# EAGLE design Adafruit 2.13in eInk Bonnet (EAGLE 9.6.2)
COMPANY: ADAFRUIT INDUSTRIES; DRAWN: K. TOWNSEND; REV: A
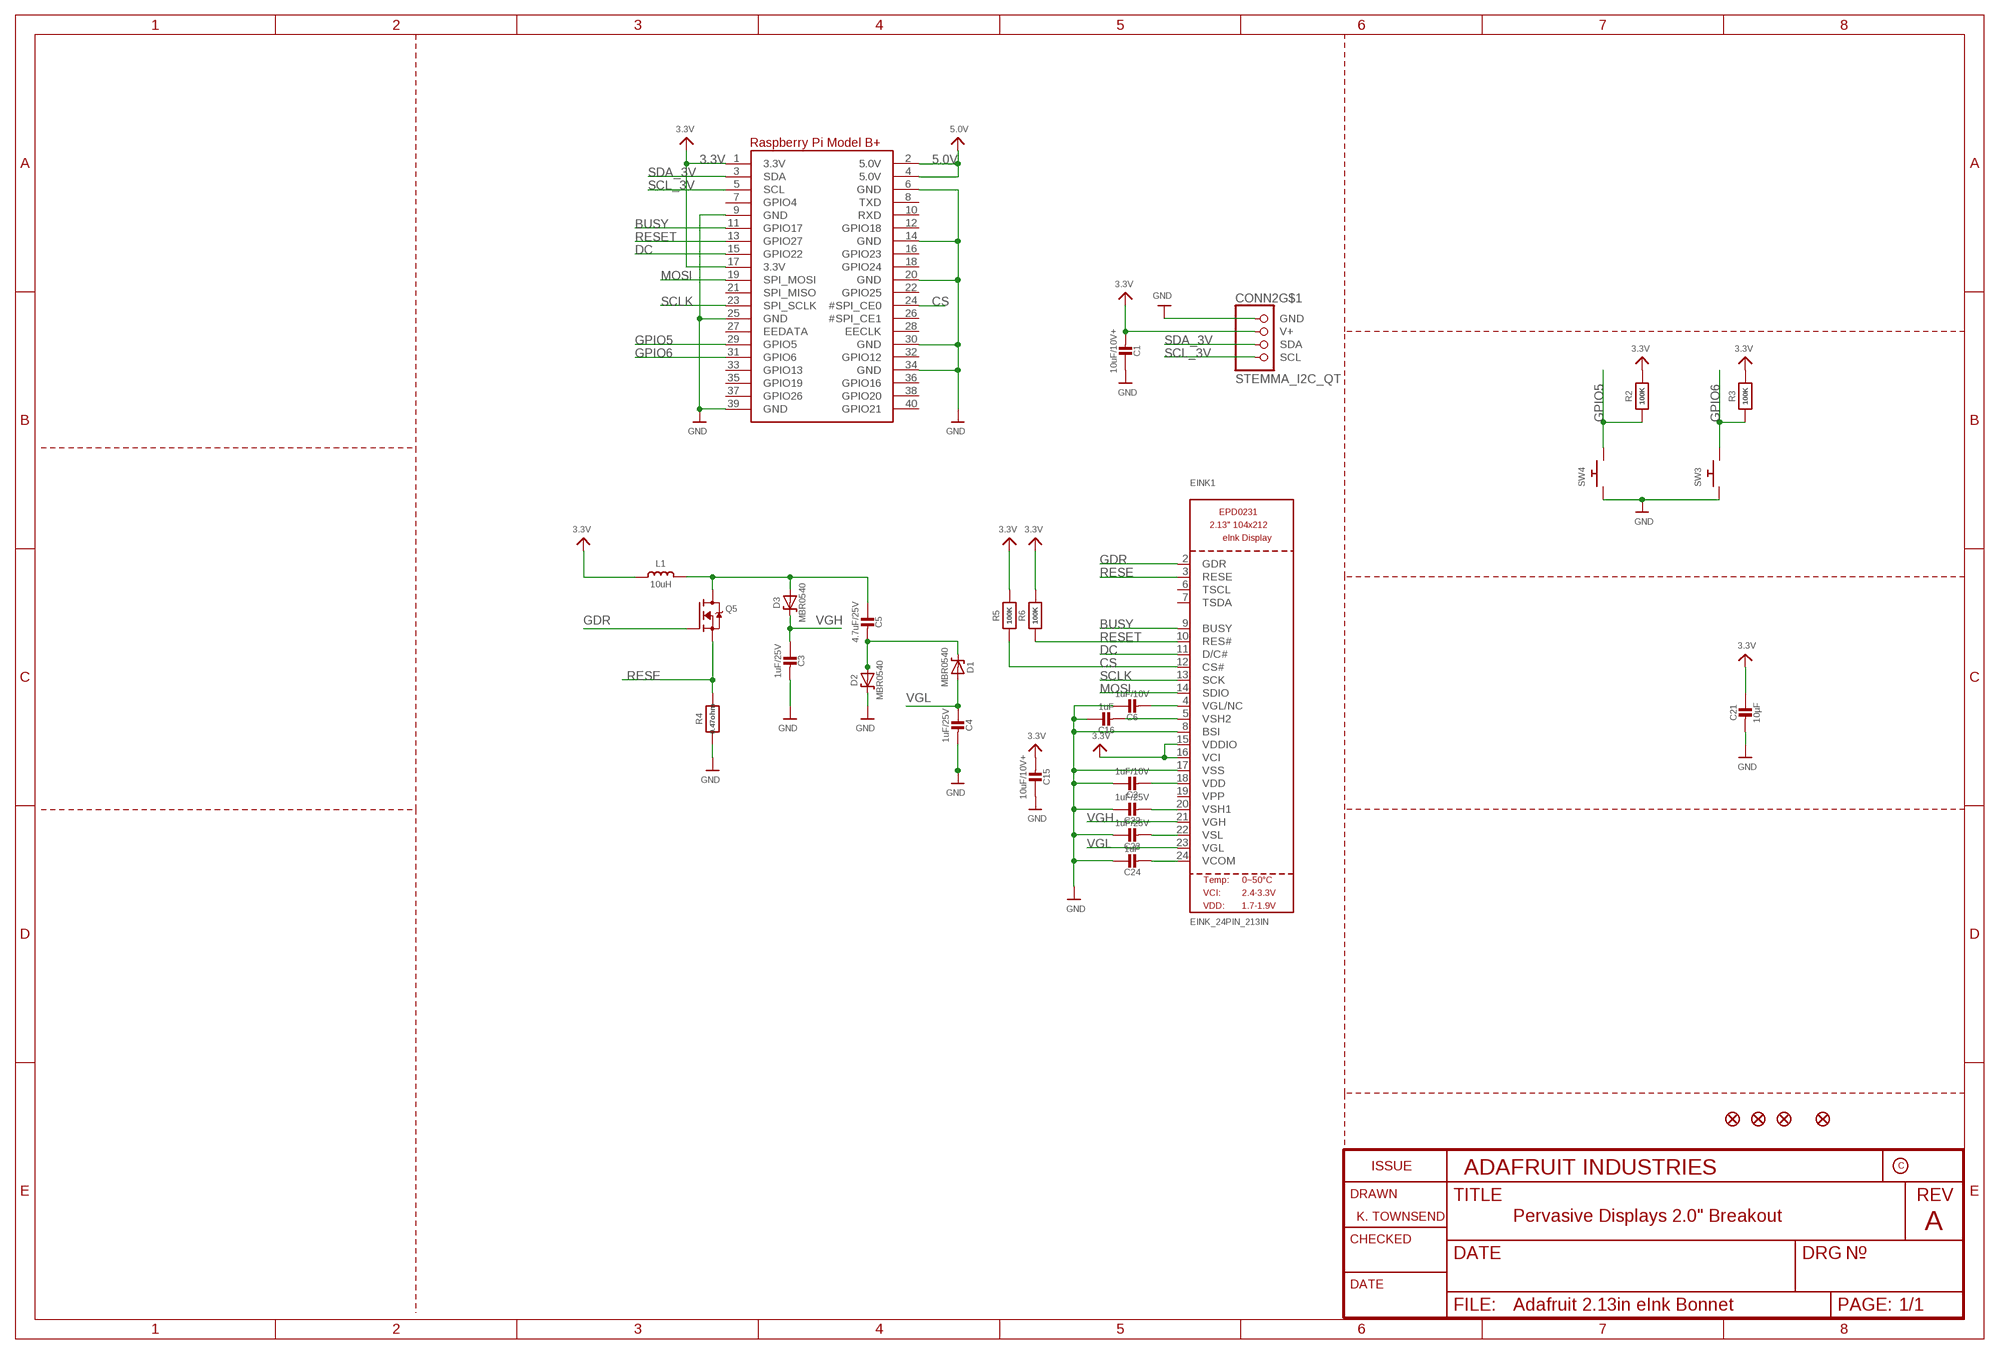
[diagram p0: schematic, sheet 1]

## Parts
C1  10uF/10V+  CAP_CERAMIC0805-NOOUTLINE  [0805-NO]
C2  1uF/10V  CAP_CERAMIC0805-NOOUTLINE  [0805-NO]
C3  1uF/25V  CAP_CERAMIC0805-NOOUTLINE  [0805-NO]
C4  1uF/25V  CAP_CERAMIC0805-NOOUTLINE  [0805-NO]
C5  4.7uF/25V  CAP_CERAMIC0805-NOOUTLINE  [0805-NO]
C6  1uF/10V  CAP_CERAMIC0805-NOOUTLINE  [0805-NO]
C15  10uF/10V+  CAP_CERAMIC0805-NOOUTLINE  [0805-NO]
C16  1uF  CAP_CERAMIC0805-NOOUTLINE  [0805-NO]
C21  10µF  CAP_CERAMIC0805-NOOUTLINE  [0805-NO]
C22  1uF/25V  CAP_CERAMIC0805-NOOUTLINE  [0805-NO]
C23  1uF/25V  CAP_CERAMIC0805-NOOUTLINE  [0805-NO]
C24  1uF  CAP_CERAMIC0805-NOOUTLINE  [0805-NO]
CONN2  STEMMA_I2C_QT  [JST_SH4]
D1  MBR0540  DIODE-SCHOTTKYSOD-123  [SOD-123]
D2  MBR0540  DIODE-SCHOTTKYSOD-123  [SOD-123]
D3  MBR0540  DIODE-SCHOTTKYSOD-123  [SOD-123]
EINK1  EINK_24PIN_213IN  [EINK_213IN_104X212]
FID1  FIDUCIAL_1MM  [FIDUCIAL_1MM]
FID2  FIDUCIAL_1MM  [FIDUCIAL_1MM]
FID3  FIDUCIAL_1MM  [FIDUCIAL_1MM]
FID4  FIDUCIAL_1MM  [FIDUCIAL_1MM]
L1  10uH  INDUCTORNR401  [INDUCTOR_4X4MM_NR401]
Q5  IRLML0100  IRLML2060TRPBF  [SOT23-3]
R2  100K  RESISTOR_0603_NOOUT  [0603-NO]
R3  100K  RESISTOR_0603_NOOUT  [0603-NO]
R4  0.47ohm  RESISTOR0805_10MGAP  [0805_10MGAP]
R5  100K  RESISTOR_0603_NOOUT  [0603-NO]
R6  100K  RESISTOR_0603_NOOUT  [0603-NO]
RPI2  RASPBERRYPI_BPLUS_SMT_NODIM  [PI_BONNET_SMT_NODIM]
SW3  SWITCH_PUSHBUTTON_3.5X6MM  [TACTILE_3X6MM]
SW4  SWITCH_PUSHBUTTON_3.5X6MM  [TACTILE_3X6MM]

## Nets
3.3V: C1.2 C15.2 C21.1 CONN2.2(V+) EINK1.15(VDDIO) EINK1.16(VCI) L1.P$2 R2.2 R3.2 R5.2 R6.2 RPI2.1(3.3V) RPI2.17(3.3V)
5.0V: RPI2.2(5.0V) RPI2.4(5.0V)
BUSY: EINK1.9(BUSY) RPI2.11(GPIO17)
CS: EINK1.12(CS#) R5.1 RPI2.24(#SPI_CE0)
DC: EINK1.11(D/C#) RPI2.15(GPIO22)
GDR: EINK1.2(GDR) Q5.1(G)
GND: C1.1 C2.1 C3.2 C4.2 C6.1 C15.1 C16.1 C21.2 C22.1 C23.1 C24.1 CONN2.1(GND) D2.C EINK1.8(BSI) EINK1.17(VSS) R4.2 RPI2.6(GND) RPI2.9(GND) RPI2.14(GND) RPI2.20(GND) RPI2.25(GND) RPI2.30(GND) RPI2.34(GND) RPI2.39(GND) SW3.P$1 SW4.P$1
GPIO5: R2.1 RPI2.29(GPIO5) SW4.P$2
GPIO6: R3.1 RPI2.31(GPIO6) SW3.P$2
MOSI: EINK1.14(SDIO) RPI2.19(SPI_MOSI)
N$2: C5.2 D1.C D2.A
N$3: C5.1 D3.A L1.P$1 Q5.3(D)
N$4: C16.2 EINK1.5(VSH2)
N$5: C2.2 EINK1.18(VDD)
N$6: C22.2 EINK1.20(VSH1)
N$9: C6.2 EINK1.4(VGL/NC)
N$27: C23.2 EINK1.22(VSL)
N$33: C24.2 EINK1.24(VCOM)
RESE: EINK1.3(RESE) Q5.2(S) R4.1
RESET: EINK1.10(RES#) R6.1 RPI2.13(GPIO27)
SCL_3V: CONN2.4(SCL) RPI2.5(SCL)
SCLK: EINK1.13(SCK) RPI2.23(SPI_SCLK)
SDA_3V: CONN2.3(SDA) RPI2.3(SDA)
VGH: C3.1 D3.C EINK1.21(VGH)
VGL: C4.1 D1.A EINK1.23(VGL)
Unconnected: CONN2.MT1(MT) CONN2.MT2(MT) EINK1.6(TSCL) EINK1.7(TSDA) EINK1.19(VPP) RPI2.7(GPIO4) RPI2.8(TXD) RPI2.10(RXD) RPI2.12(GPIO18) RPI2.16(GPIO23) RPI2.18(GPIO24) RPI2.21(SPI_MISO) RPI2.22(GPIO25) RPI2.26(#SPI_CE1) RPI2.27(EEDATA) RPI2.28(EECLK) RPI2.32(GPIO12) RPI2.33(GPIO13) RPI2.35(GPIO19) RPI2.36(GPIO16) RPI2.37(GPIO26) RPI2.38(GPIO20) RPI2.40(GPIO21)

## Notes on the sheet
- Pervasive Displays 2.0" Breakout

## Library data of the parts
C1-C6 C15 C16 C21-C24 = microbuilder:CAP_CERAMIC: Ceramic Capacitors For new designs, use the packages preceded by an '_' character since they are more reliable: The following footprints should be used on most boards: _0402 - Standard footprint for regular board layouts _0603 - Standard footprint for regular board layouts _0805 - Standard footprint for regular board layouts _1206 - Standard footprint for regular board layouts For extremely tight-pitch boards where space is at a premium, the following 'micro-pitch' footprints can be used (smaller pads, no silkscreen outline, etc.): _0402MP - Micro-pitch footprint for very dense/compact boards _0603MP - Micro-pitch footprint for very dense/compact boards _0805MP - Micro-pitch footprint for very dense/compact boards _1206MP - Micro-pitch footprint for very dense/compact boards
CONN2 = microbuilder:STEMMA_I2C
D1-D3 = microbuilder:DIODE-SCHOTTKY
EINK1 = adafruit_display:EINK_24PIN
FID1-FID4 = microbuilder:FIDUCIAL: Fiducial Alignment Points Various fiducial points for machine vision alignment.; BOM: EXCLUDE
L1 = microbuilder:INDUCTOR: Inductors 0603: 10nH Ceramic Inductor - microwire antenna/RF (Digikey: 712-1434-2-ND) 0805: 560nH Ceramic Inductor - RF (Digikey: 553-1047-1-ND) 270nH Ceramic Inductor - Q = 40@250MHz, +-5%, 1 Ohm DC Resistance (Digikey: 535-10506-2-ND) 1007 (2518 Metric) SMT: 10µH 10% 250mOhm 820mA 1007 Inductor (Digikey: 587-2189-1-ND) 22µH 10% 500mOhm 580mA 1007 Inductor (Digikey: 587-2190-1-ND) 47µH 10% 950mOhm 420mA 1007 Inductor (Digikey: 587-2191-1-ND) 47µH 5% 100mOhm 1A 1008 Inductor (Digikey: 732-1816-1-ND) 5.0x5.0mm (Taiyo Yuden NR5040 Series) 6.8µH 20% 2.3A 64mOhm Inductor (Digikey: 587-2374-2-ND) 5.0x5.0mm (TDK VLC5045 Series) 4.7µH 20% 3.3A 34mOhm Inductor (Digikey: 445-6526-1-ND) 6.8µH 20% 2.7A 46mOhm Inductor (Digikey: 445-6527-1-ND) 6.0x6.0mm (TDK VLC6045 Series) 4.7µH 20% 3.8A 27mOhm Inductor (Digikey: 445-6538-2-ND) 6.8µH 20% 3A 41mOhm Inductor (Digikey: 445-6540-1-ND) 6.2µH 30% 2.2A 45mOhm Inductor (Digikey: SRR5028-6R2YCT-ND) - Not TDK VLC6045 but footprint should match 6.0x6.0mm (TDK SLF6045 Series) 6.8uH 30% 2A 33mOhm Inductor (Digikey: 445-4572-1-ND, Mouser: 810-SLF645T6R8N2R0PF) 6.0x6.0mm (Sumida CDRH5D28 Series) 6.2uH 30% 1.8A 45mOhm Inductor (Digikey: 308-1542-1-ND) Taiyo Yuden NR3015T2R2M - 2.2uH 20% 1.5A (Digikey: 587-1648-2-ND, Mouser: 963-NR3015T2R2M) - Used with TI TPS62172 CoilCraft RFID Transponder Coil - MA5532-AE (For use with AS3935 Lightning Sensor) Taiyo Yuden NRH2412T2R2MNGH - 2.2uH 20% 1AA (Digikey: 587-3443-1-ND) - Used with TI LM3671 Vishay IHLP 1.0uH Molded Inductor - 24mOhm DCR, 5A, +/-20%, -55°C-125°C (Digikey: 541-1319-1-ND)
Q5 = Parts:IRLML2060TRPBF
R2-R6 = microbuilder:RESISTOR: Resistors For new designs, use the packages preceded by an '_' character since they are more reliable: The following footprints should be used on most boards: _0402 - Standard footprint for regular board layouts _0603 - Standard footprint for regular board layouts _0805 - Standard footprint for regular board layouts _1206 - Standard footprint for regular board layouts For extremely tight-pitch boards where space is at a premium, the following 'micro-pitch' footprints can be used (smaller pads, no silkscreen outline, etc.): _0402MP - Micro-pitch footprint for very dense/compact boards _0603MP - Micro-pitch footprint for very dense/compact boards _0805MP - Micro-pitch footprint for very dense/compact boards _1206MP - Micro-pitch footprint for very dense/compact boards
RPI2 = adafruit_sbc:RASPBERRYPI_BPLUS
SW3 SW4 = microbuilder:SWITCH_PUSHBUTTON: Buttons SOFTTOUCHSMD_SJ - Soft touch temporary push button (Super Junk Akihabara) Compatible with SKPMANE010 [Mouser: 688-SKPMAN] C&K_KSS = Digikey: KSS221GLFS

## Net classes
1 power: width 0.305 mm

## Board
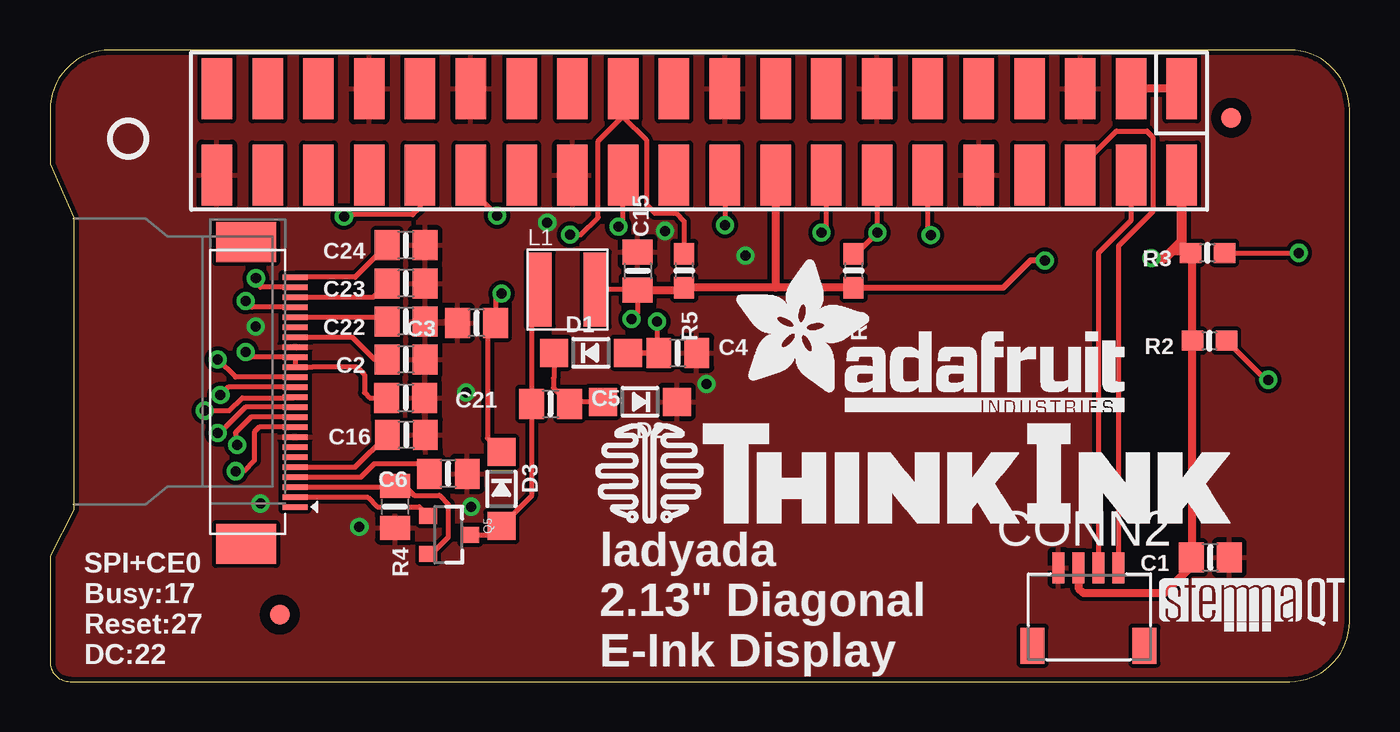
[diagram p1: board, top side]
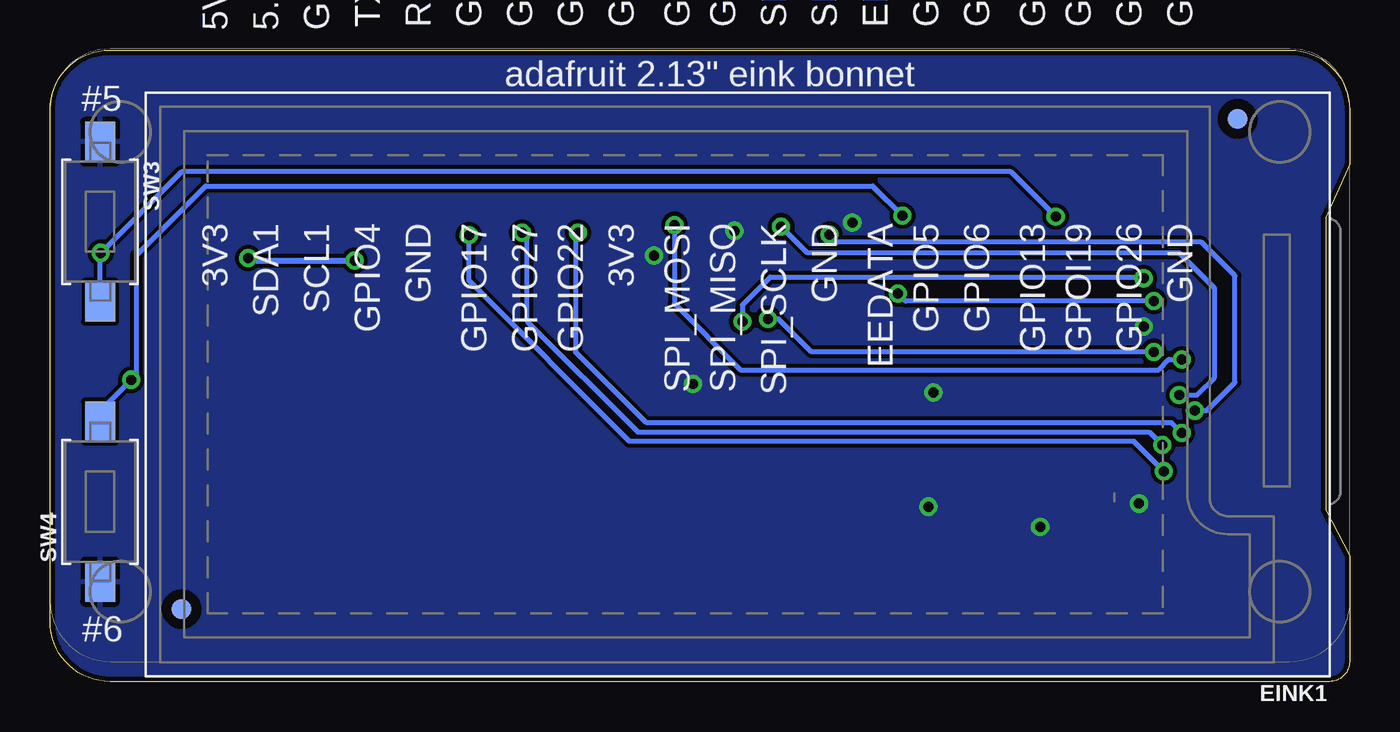
[diagram p2: board, bottom side, seen from below]

Size 65 x 31.6 mm. Coordinates in mm from the lower left corner, seen from the top.
Outline: 0,28.6 0,25.9 1.2,23.2 1.2,8.6 0,6.3 0,1 arc90 1,0 62,0 arc90 65,3 65,28.6 arc90 62,31.6 3,31.6 arc90 0,28.6
Copper layers (1*16): Top 0.035mm / dielectric 1.5mm / Bottom 0.035mm
Design rules "adafruit *": minimum track width 8mil, minimum drill 15.5mil, track to track 8mil, track to pad 8mil, pad to pad 8mil, via to via 8mil, smd to smd 8mil, copper to edge 10mil, drill to drill 8mil, minimum pad ring 10mil, minimum via ring 8mil, stop-mask expansion 2mil, vias tented up to drill 20mil, thermal gap 10mil

### Footprints (pad centres in the part's own frame; a part is rotated, then mirrored left to right if it is on the bottom)
0805-NO = smd 1.24 x 1.5: 1 -0.95,0; 2 0.95,0
JST_SH4 = smd 0.6 x 1.55: 1 -1.5,2.514; 2 -0.5,2.514; 3 0.5,2.514; 4 1.5,2.514 | smd 1.2 x 1.8: MT1 -2.8,-1.386; MT2 2.8,-1.386
SOD-123 = smd 1.4 x 1.4: A 1.85,0; C -1.85,0
EINK_213IN_104X212 = smd 1.25 x 0.275 bottom: 1 11.26,-8.46; 2 11.26,-8.96; 3 11.26,-9.46; 4 11.26,-9.96; 5 11.26,-10.46; 6 11.26,-10.96; 7 11.26,-11.46; 8 11.26,-11.96; 9 11.26,-12.46; 10 11.26,-12.96; 11 11.26,-13.46; 12 11.26,-13.96; 13 11.26,-14.46; 14 11.26,-14.96; 15 11.26,-15.46; 16 11.26,-15.96; 17 11.26,-16.46; 18 11.26,-16.96; 19 11.26,-17.46; 20 11.26,-17.96; 21 11.26,-18.46; 22 11.26,-18.96; 23 11.26,-19.46; 24 11.26,-19.96 | smd 3 x 2 bottom: SPRT1 8.8,-6.61; SPRT2 8.8,-21.72
FIDUCIAL_1MM = smd 1 x 1: 1 0,0
INDUCTOR_4X4MM_NR401 = smd 1.2 x 3.7: P$1 -1.4,0; P$2 1.4,0
SOT23-3 = smd 0.8 x 0.9: 1 -0.95,-1; 2 0.95,-1; 3 0,1.1
0603-NO = smd 1.075 x 1: 1 -0.85,0; 2 0.85,0
0805_10MGAP = smd 1.2 x 1.5: 1 -1.05,0; 2 1.05,0
PI_BONNET_SMT_NODIM = smd 1.524 x 3.048 bottom: 1 8.37,24.339; 2 8.37,28.657; 3 10.91,24.339; 4 10.91,28.657; 5 13.45,24.339; 6 13.45,28.657; 7 15.99,24.339; 8 15.99,28.657; 9 18.53,24.339; 10 18.53,28.657; 11 21.07,24.339; 12 21.07,28.657; 13 23.61,24.339; 14 23.61,28.657; 15 26.15,24.339; 16 26.15,28.657; 17 28.69,24.339; 18 28.69,28.657; 19 31.23,24.339; 20 31.23,28.657; 21 33.77,24.339; 22 33.77,28.657; 23 36.31,24.339; 24 36.31,28.657; 25 38.85,24.339; 26 38.85,28.657; 27 41.39,24.339; 28 41.39,28.657; 29 43.93,24.339; 30 43.93,28.657; 31 46.47,24.339; 32 46.47,28.657; 33 49.01,24.339; 34 49.01,28.657; 35 51.55,24.339; 36 51.55,28.657; 37 54.09,24.339; 38 54.09,28.657; 39 56.63,24.339; 40 56.63,28.657
TACTILE_3X6MM = smd 2 x 1.5: P$1 -4,0; P$2 4,0

### Placement (x,y rotation side)
C1  58.04,6.21 180 top
C2  17.81,16.11 180 top
C3  21.34,17.94 180 top
C4  31.4,16.44 0 top
C5  25.03,13.89 0 top
C6  19.92,10.4 180 top
C15  29.4,20.54 270 top
C16  17.83,12.34 180 top
C21  17.79,14.2 0 top
C22  17.81,18.02 180 top
C23  17.81,19.92 180 top
C24  17.81,21.83 180 top
CONN2  51.94,3.18 0 top
D1  27.05,16.44 0 top
D2  29.51,13.99 180 top
D3  22.59,9.64 270 top
EINK1  1,0.27 180 bottom
FID1  59.08,28.21 0 top
FID2  58.42,3.62 90 bottom
FID3  5.59,28.15 0 bottom
FID4  11.49,3.35 0 top
L1  25.89,19.62 0 top
Q5  19.92,7.35 270 top
R2  58,17.05 180 top
R3  57.89,21.45 180 top
R4  17.25,8.75 270 top
R5  31.72,20.56 270 top
R6  40.19,20.56 270 top
RPI2  64.98,1 0 bottom
SW3  62.5,23 270 bottom
SW4  62.5,9 90 bottom
U$9  [PCBFEAT-REV-040]  3.92,27.16 0 top
U$28  [ADAFRUIT_TEXT_20MM]  34.18,13.49 0 top
U$29  [THINKINK_1.25IN]  27.29,7.91 0 top
U$30  [STEMMAQT]  55.5,2.52 0 top

### Tracks (layer width: path | path; a pad name or v marks a point on that pad's centre or on a via)
3.3V  (via drill 0.5)
  Top 0.254: L1.P$2 28.76,19.62 28.78,19.59 C15.2 | C21.1 15.99,14.2 15.73,14.46 15.73,15.35 15.35,15.73 13.1,15.73 EINK1.15 EINK1.16 10.06,16.23 v9.79,16.49 | v29.09,18.15 29.4,18.45 C15.2 | C15.2 29.3,19.59 | R3.2 56.9,21.45 56.1,21.45 55.85,21.19 v55.09,21.19
  Top 0.305: v49.77,21.07 49.04,21.07 47.68,19.71 R6.2
  Top 0.406: 29.3,19.59 31.6,19.59 R5.2 36.3,19.71 | R6.2 36.3,19.71 | RPI2.17 36.29,19.72 36.3,19.71 | CONN2.2 51.44,4.67 51.69,4.43 55.75,4.43 57.15,5.82 57.15,6.27 | 57.15,6.27 R2.2 57.15,21.2 56.9,21.45 | C1.2 57.15,6.27
  Top 0.508: RPI2.1 56.61,22.04 55.77,21.19 v55.09,21.19
  Bottom 0.254: v9.79,16.49 26.91,16.49 28.56,18.15 v29.09,18.15
  Bottom 0.305: v49.77,21.07 54.96,21.07 v55.09,21.19
5.0V
  Top 0.406: RPI2.2 RPI2.4
BUSY  (via drill 0.5)
  Top 0.254: v9.28,10.53 9.68,10.53 10.22,11.06 10.22,12.48 10.47,12.73 EINK1.9 | v44.05,22.34 43.91,22.48 RPI2.11
  Bottom 0.254: v9.28,10.53 10.78,12.02 36.02,12.02 44.05,20.05 v44.05,22.34
CS  (via drill 0.5)
  Top 0.254: EINK1.12 12.22,14.2 9.62,14.2 8.97,13.55 v7.74,13.55 | v26.02,22.36 26.55,22.36 27.41,23.22 27.41,27.04 28.67,28.29 | 28.67,28.29 RPI2.24 | 28.67,28.29 28.67,28.26 29.83,27.11 29.83,23.85 30.25,23.43 31.31,23.43 31.72,23.02 R5.1
  Bottom 0.254: v7.74,13.55 7.15,13.55 5.73,14.97 5.73,20.3 7.4,21.98 25.64,21.98 v26.02,22.36
DC  (via drill 0.5)
  Top 0.254: v38.59,22.46 38.83,22.7 RPI2.15 | EINK1.11 9.8,13.73 8.5,12.43 v8.39,12.43
  Bottom 0.254: v8.39,12.43 8.9,12.94 35.16,12.94 38.72,16.49 38.72,22.34 v38.59,22.46
GDR
  Top 0.254: Q5.1 18.47,8.75 16.36,8.75 15.91,9.21 12.28,9.21 EINK1.2
GND  (via drill 0.5)
  other vias: 34.78,21.32 32.84,14.89 10.28,17.76 10.53,8.9 24.87,22.97 30.77,22.55 20.81,14.46 21.06,8.75 15.47,7.73
  pour Top: 0,31.6 0,-0.1 65,0 65,31.6
  pour Bottom: -0.02,31.61 -0.02,0.11 64.75,0.11 64.75,31.61
GPIO5  (via drill 0.5)
  Top 0.254: RPI2.29 21.05,24.63 v22.37,23.32 | v60.94,15.1 60.81,15.1 R2.1
  Bottom 0.254: v22.37,23.32 23.85,24.8 57.21,24.8 60.69,21.32 60.69,15.35 v60.94,15.1 62.5,13.54 SW4.P$2
GPIO6  (via drill 0.5)
  Top 0.254: v14.7,23.27 14.78,23.35 18.14,23.35 18.51,23.72 RPI2.31 | R3.1 v62.46,21.45
  Bottom 0.254: v14.7,23.27 16.94,25.51 58.4,25.51 v62.46,21.45 62.5,21.41 SW3.P$2
MOSI  (via drill 0.5)
  Top 0.254: v8.39,16.11 9.28,15.23 EINK1.14 | RPI2.19 33.75,22.86 v33.76,22.84
  Bottom 0.254: v33.76,22.84 33.76,18.91 30.46,15.6 9.54,15.6 9.03,16.11 v8.39,16.11
N$2
  Top 0.254: D1.C 25.2,15.18 25.18,15.16 25.18,14.69 C5.2 26.08,13.99 D2.A
N$3
  Top 0.254: L1.P$1 24.08,19.21 C5.1 24.08,9.28 D3.A 22.15,7.35 Q5.3
N$4
  Top 0.254: C16.2 15.27,10.73 15.26,10.73 EINK1.5
N$5
  Top 0.254: C2.2 16.24,16.11 15.12,17.23 EINK1.18
N$6
  Top 0.254: EINK1.20 16.65,18.23 C22.2
N$9
  Top 0.254: C6.2 18.46,10.91 16.24,10.91 15.56,10.23 EINK1.4
N$27
  Top 0.254: C23.2 16.17,19.23 EINK1.22
N$33
  Top 0.254: C24.2 15.26,20.23 EINK1.24
RESE
  Top 0.254: Q5.2 19.1,6.4 19.92,7.22 19.92,8.87 19.48,9.32 18.21,9.32 17.73,9.8 R4.1 17.18,9.73 EINK1.3
RESET  (via drill 0.5)
  Top 0.254: R6.1 40.33,21.41 v41.38,22.46 41.38,25.33 RPI2.13 | EINK1.10 10.06,13.23 9.28,12.46 9.28,11.92 v9.37,11.84
  Bottom 0.254: v41.38,22.46 41.13,22.21 41.13,18.02 35.59,12.48 10.02,12.48 v9.37,11.84
SCL_3V
  Top 0.254: RPI2.5 51.53,25.73 53.34,27.54 54.86,27.54 55.16,27.24 55.16,23.51 53.44,21.79 CONN2.4
SCLK  (via drill 0.5)
  Top 0.254: v28.43,22.77 28.67,23.01 RPI2.23 | EINK1.13 8.92,14.73 v8.52,14.34
  Bottom 0.254: v8.52,14.34 7.63,14.34 6.74,15.22 6.74,19.67 8.52,21.45 27.11,21.45 v28.43,22.77
SDA_3V
  Top 0.254: RPI2.3 54.07,23.07 52.44,21.44 CONN2.3
VGH  (via drill 0.5)
  Top 0.254: v22.59,19.42 22.29,19.12 C3.1 21.89,17.54 21.89,12.19 D3.C | EINK1.21 10.1,18.73 v9.79,19.03
  Bottom 0.254: v22.59,19.42 22.21,19.03 v9.79,19.03
VGL  (via drill 0.5)
  Top 0.254: v10.3,20.18 10.3,20.05 10.25,20 10.52,19.73 EINK1.23 | v30.37,18.02 30.37,16.44 D1.A C4.1
  Bottom 0.254: v30.37,18.02 30.37,18.84 28.97,20.24 10.36,20.24 v10.3,20.18

### Text on the board
tPlace: ladyada / 2.13" Diagonal / E-Ink Display | SPI+CE0 / Busy:17 / Reset:27 / DC:22
bPlace: adafruit 2.13" eink bonnet | #5 | #6